# Altium schematic sheet Regulator.SchDoc: Power Regulator
size A4; SheetNumber: 3; SheetTotal: 10
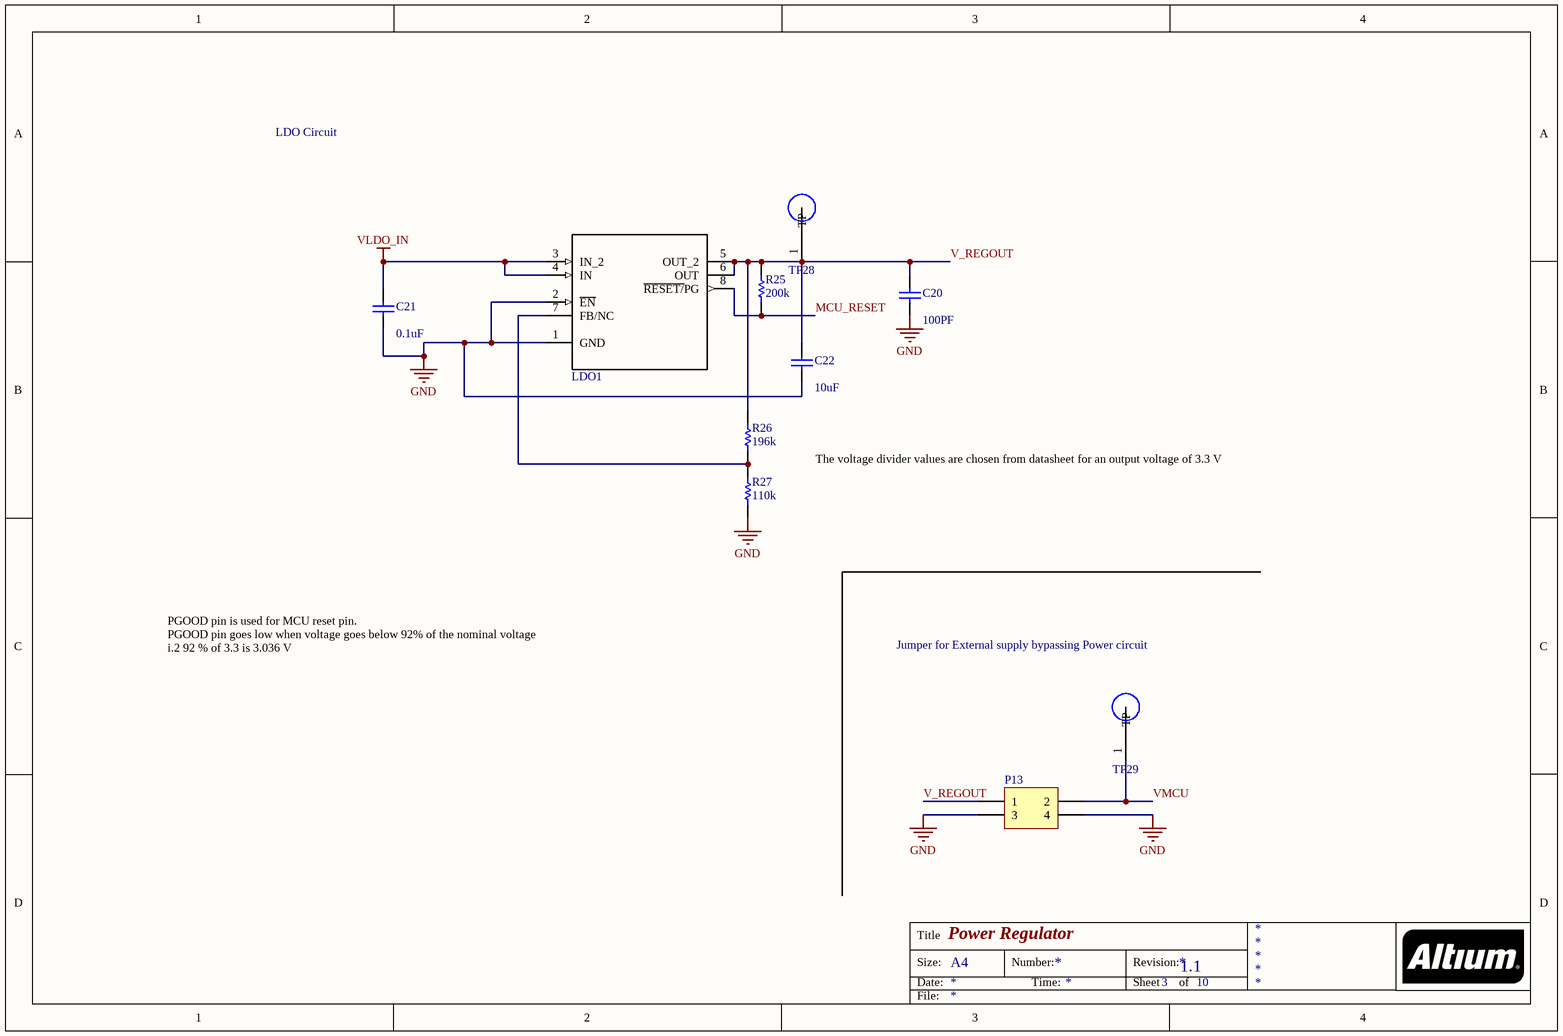
[diagram p0: Regulator.SchDoc]

## Parts
C20  value 100PF  [C0805]  (hidden comment: Cap)
C21  value 0.1uF  [1608[0603]]  (hidden comment: Cap)
C22  value 10uF  [1608[0603]]  (hidden comment: Cap)
LDO1  LDO  [LDO]  (value not drawn)
P13  Header 2X2H  [HDR2X2H]  (value not drawn)
R25  value 200k  [1608[0603]]  (hidden comment: Res1)
R26  value 196k  [1608[0603]]  (hidden comment: Res1)
R27  value 110k  [1608[0603]]  (hidden comment: Res1)
TP28  TP  [TP]  (value not drawn)
TP29  TP  [TP]  (value not drawn)

## Nets
GND: C20.1 C21.1 C22.1 LDO1.1(GND) LDO1.2(~{EN}) P13.3 P13.4 R27.2
VLDO_IN: C21.2 LDO1.3(IN_2) LDO1.4(IN)
MCU_RESET: LDO1.8(~{RESET/}PG) R25.2
V_REGOUT: C20.2 C22.2 LDO1.5(OUT_2) LDO1.6(OUT) P13.1 R25.1 R26.1 TP28.1(TP)
VMCU: P13.2 TP29.1(TP)
NetLDO1_7: LDO1.7(FB/NC) R26.2 R27.1

## Notes on the sheet
- LDO Circuit
- The voltage divider values are chosen from datasheet for an output voltage of 3.3 V
- Jumper for External supply bypassing Power circuit
- PGOOD pin is used for MCU reset pin.
  PGOOD pin goes low when voltage goes below 92% of the nominal voltage
  i.2 92 % of 3.3 is 3.036 V
- 1.1
- Title
- Size:
- Date:
- A4
- Number:
- Time:
- Revision:
- Sheet
- of
- File:

## Library data of the parts
C20 = Cap: CAP CER 100PF 50V C0G/NP0 0805; Manufacturer: KEMET; Manufacturer Part Number: C0805C101J5GACTU; Digi-Key Part Number: 399-1122-1-ND; DigiKeyURL: https://www.digikey.com/product-detail/en/kemet/C0805C101J5GACTU/399-1122-1-ND/411397
C21 C22 = Cap: 10000pF ±10% 50V Ceramic Capacitor X7R 0603 (1608 Metric); Manufacturer: Samsung Electro-Mechanics; Manufacturer Part Number: CL10B103KB8NNNC; Digi-Key Part Number: 1276-1009-1-ND; digi key link url: https://www.digikey.com/product-detail/en/samsung-electro-mechanics/CL10B103KB8NNNC/1276-1009-1-ND/3889095
LDO1 = LDO: IC REG LINEAR 3.3V 750MA 8SOIC; Manufacturer: Texas Instruments; Manufacturer Part Number: TPS77833D; Snapeda_Url: https://www.snapeda.com/parts/TPS77833D/Texas%20Instruments/view-part/?ref=search&t=TPS77833D; DigiKeyURL: https://www.digikey.com/product-detail/en/texas-instruments/TPS77833D/296-2792-5-ND/306665; Digi-Key Part Number: 296-2792-5-ND
P13 = Header 2X2H: CONN HEADER VERT 8POS 2.54MM; Manufacturer: TE Connectivity AMP Connectors; Manufacturer Part Number: 5-146256-4; Digi-Key Part Number: A121467-ND; DigiKeyURL: https://www.digikey.com/product-detail/en/te-connectivity/5-146256-4/A121467-ND/2275818
R25-R27 = Res1: 10 kOhms ±1% 0.125W, 1/8W Chip Resistor 0603 (1608 Metric) Anti-Sulfur, Moisture Resistant Thin Film; Manufacturer: Stackpole Electronics Inc; Manufacturer Part Number: RNCP0603FTD10K0; Digi-Key Part Number: RNCP0603FTD10K0CT-ND; digi key link url: https://www.digikey.com/product-detail/en/stackpole-electronics-inc/RNCP0603FTD10K0/RNCP0603FTD10K0CT-ND/2240478
TP28 TP29 = TP: PC TEST POINT MINIATURE; Manufacturer: Keystone Electronics; Manufacturer Part Number: 5019; Snapeda_Url: https://www.snapeda.com/parts/5019/Keystone%20Electronics/view-part/?ref=search&t=5019; DigiKeyURL: https://www.digikey.com/product-detail/en/keystone-electronics/5019/36-5019CT-ND/3907344?utm_source=snapeda&utm_medium=aggregator&utm_campaign=symbol; Digi-Key Part Number: 36-5019CT-ND